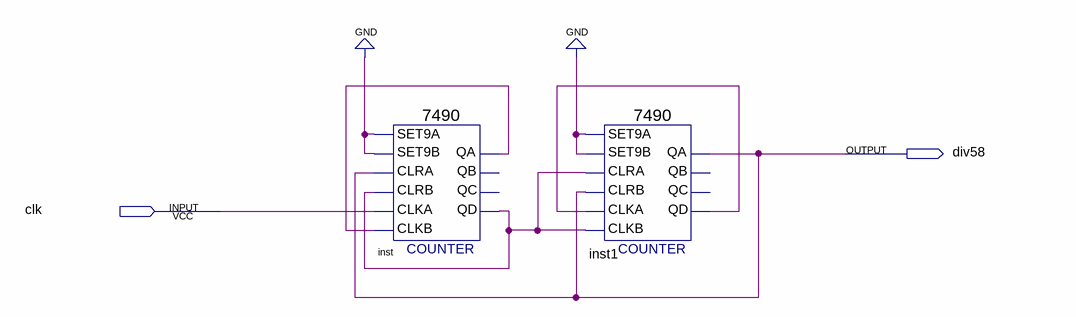
[diagram p0: schematic sheet]
// Quartus schematic div_58.bdf as structural Verilog: 2 symbols, 2 pins
module div_58 (
  input  clk,
  output div58
);

  wire inst1_qd, inst_qa, inst_qd;

  \7490  inst (
    .SET9A(1'b0), .CLRA(div58), .SET9B(1'b0), .CLKB(inst_qa), .CLKA(clk), .CLRB(inst_qd), .QD(inst_qd),
    .QA(inst_qa));  // open: QB, QC
  \7490  inst1 (
    .SET9A(1'b0), .CLRA(inst_qd), .SET9B(1'b0), .CLKB(inst_qd), .CLKA(inst1_qd), .CLRB(div58), .QD(inst1_qd),
    .QA(div58));  // open: QB, QC
endmodule
